# EAGLE design sensor_board3 (EAGLE 9.1.3)
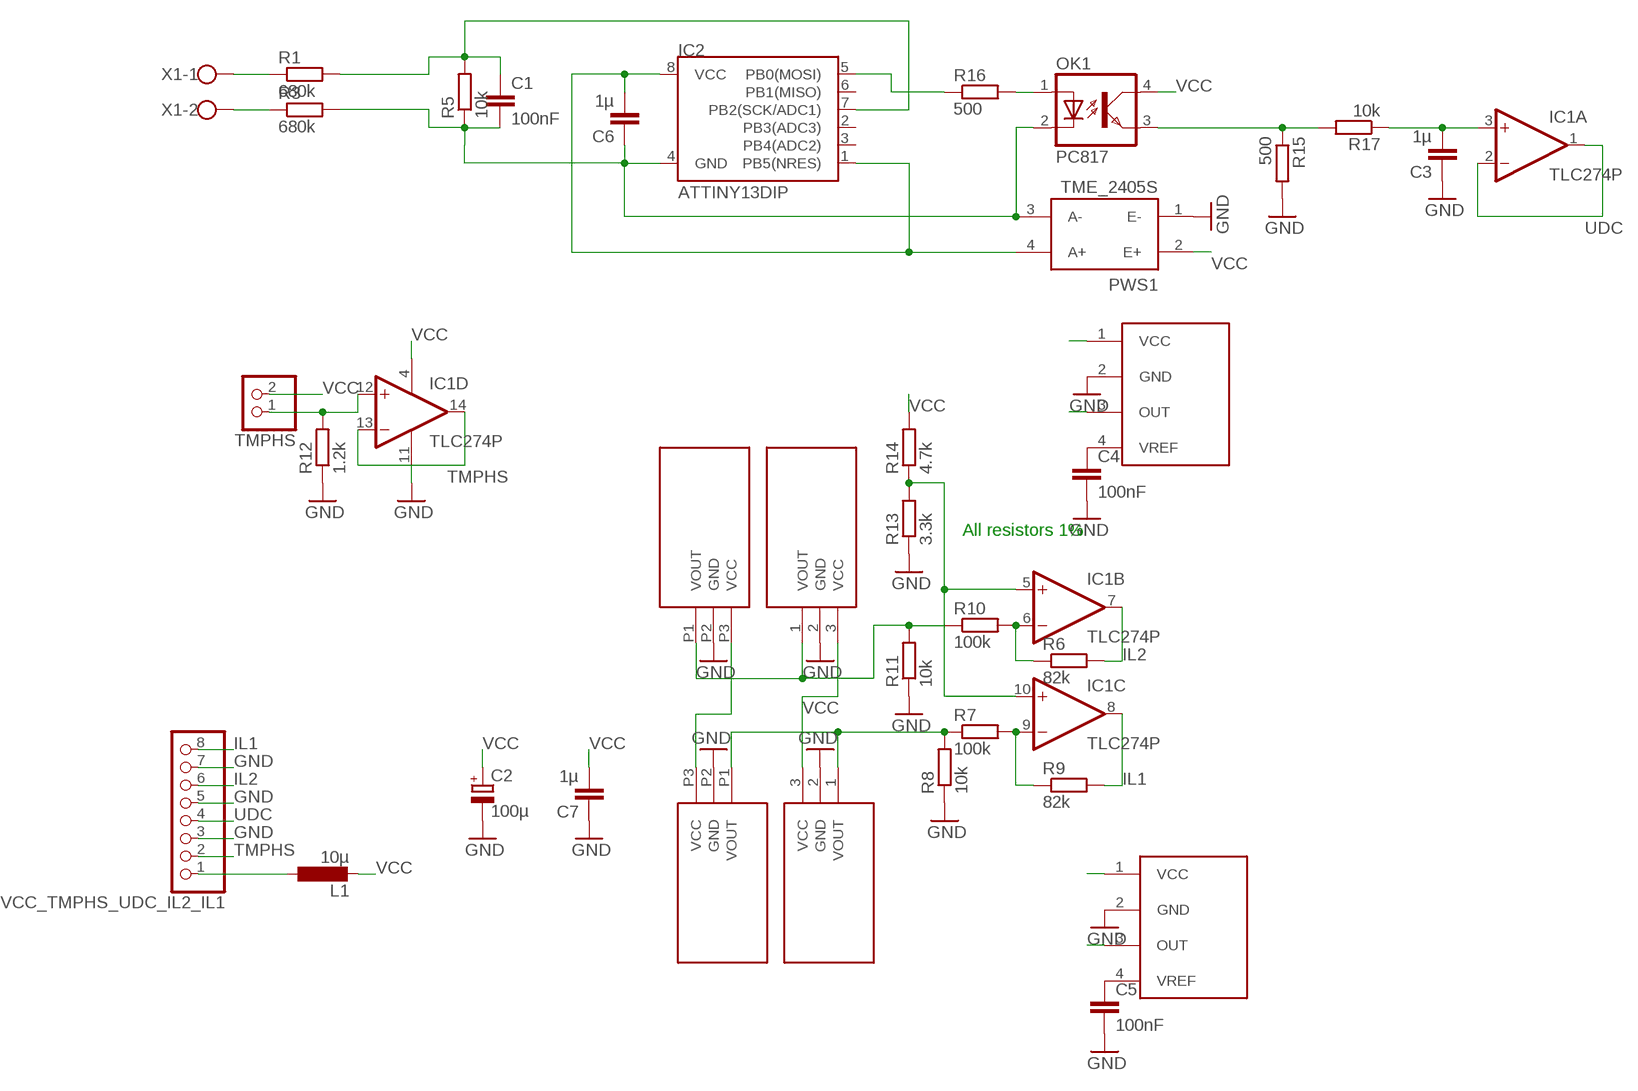
[diagram p0: schematic, sheet 1]

## Parts
C1  100nF  C-EU025-024X044  [C025-024X044]
C2  100µ  CPOL-EUE2,5-6E  [E2,5-6E]
C3  1µ  C-EU025-024X044  [C025-024X044]
C4  100nF  C-EU025-024X044  [C025-024X044]
C5  100nF  C-EU025-024X044  [C025-024X044]
C6  1µ  C-EU025-024X044  [C025-024X044]
C7  1µ  C-EU025-024X044  [C025-024X044]
IC1  TLC274P  [DIL14]
IC2  ATTINY13DIP  [DIP08]
L1  10µ  L-EU0207/12  [0207/12]
OK1  PC817  [DIL04]
PWS1  TME_2405S  [TMEXXXXS]
R1  680k  R-EU_0207/10  [0207/10]
R3  680k  R-EU_0207/10  [0207/10]
R5  10k  R-EU_0207/10  [0207/10]
R6  82k  R-EU_0207/10  [0207/10]
R7  100k  R-EU_0207/10  [0207/10]
R8  10k  R-EU_0207/10  [0207/10]
R9  82k  R-EU_0207/10  [0207/10]
R10  100k  R-EU_0207/10  [0207/10]
R11  10k  R-EU_0207/10  [0207/10]
R12  1.2k  R-EU_0207/10  [0207/10]
R13  3.3k  R-EU_0207/10  [0207/10]
R14  4.7k  R-EU_0207/10  [0207/10]
R15  500  R-EU_0207/10  [0207/10]
R16  500  R-EU_0207/10  [0207/10]
R17  10k  R-EU_0207/10  [0207/10]
TMPHS  PINHD-1X2  [1X02]
U$1  TAMURA_L01Z_S05  [TAMURA_L01Z_S05]
U$2  TAMURA_L01Z_S05  [TAMURA_L01Z_S05]
U$3  HTFS  [HTFS]
U$4  HTFS  [HTFS]
U$5  TAMURA_L06P_S05L06P  [TAMURA_L06P_S05]
U$6  TAMURA_L06P_S05L06P  [TAMURA_L06P_S05]
VCC_TMPHS_UDC_IL2_IL1  PINHD-1X8  [1X08]
X1  W237-102  [W237-102]

## Nets
GND: C2.- C3.1 C4.2 C5.2 C7.1 IC1.11(P:V-) PWS1.1(E-) R8.1 R11.1 R12.1 R13.1 R15.2 U$1.2(GND) U$2.2(GND) U$3.2(GND) U$4.2(GND) U$5.P2(GND) U$6.P2(GND) VCC_TMPHS_UDC_IL2_IL1.3 VCC_TMPHS_UDC_IL2_IL1.5 VCC_TMPHS_UDC_IL2_IL1.7
GND2: C1.2 C6.1 IC2.4(GND) OK1.2(C) PWS1.3(A-) R3.2 R5.1
IL1: IC1.8(C:OUT) R9.2 VCC_TMPHS_UDC_IL2_IL1.8
IL2: IC1.7(B:OUT) R6.2 VCC_TMPHS_UDC_IL2_IL1.6
N$3: IC1.5(B:+IN) IC1.10(C:+IN) R13.2 R14.1
N$4: C1.1 IC2.7(PB2(SCK/ADC1)) R1.2 R5.2
N$5: R1.1 X1.1
N$6: R3.1 X1.2
N$7: L1.1 VCC_TMPHS_UDC_IL2_IL1.1
N$8: IC1.9(C:-IN) R7.2 R9.1
N$9: IC1.6(B:-IN) R6.1 R10.2
N$10: OK1.3(EMIT) R15.1 R17.2
N$11: C4.1 U$3.4(VREF)
N$12: C5.1 U$4.4(VREF)
N$16: IC1.12(D:+IN) R12.2 TMPHS.1
N$17: OK1.1(A) R16.2
N$18: IC2.5(PB0(MOSI)) R16.1
N$19: C3.2 IC1.3(A:+IN) R17.1
TMPHS: IC1.13(D:-IN) IC1.14(D:OUT) VCC_TMPHS_UDC_IL2_IL1.2
UDC: IC1.1(A:OUT) IC1.2(A:-IN) VCC_TMPHS_UDC_IL2_IL1.4
VCC: C2.+ C7.2 IC1.4(P:V+) L1.2 OK1.4(COL) PWS1.2(E+) R14.2 TMPHS.2 U$1.3(VCC) U$2.3(VCC) U$3.1(VCC) U$4.1(VCC) U$5.P3(VCC) U$6.P3(VCC)
VCC2: C6.2 IC2.1(PB5(NRES)) IC2.8(VCC) PWS1.4(A+)
VOUT1: R7.1 R8.2 U$2.1(VOUT) U$4.3(OUT) U$6.P1(VOUT)
VOUT2: R10.1 R11.2 U$1.1(VOUT) U$3.3(OUT) U$5.P1(VOUT)
Unconnected: IC2.2(PB3(ADC3)) IC2.3(PB4(ADC2)) IC2.6(PB1(MISO))

## Notes on the sheet
- All resistors 1%

## Library data of the parts
C1 C3-C7 = rcl:C-EU: CAPACITOR, European symbol
C2 = rcl:CPOL-EU: POLARIZED CAPACITOR, European symbol
IC1 = linear:TLC274: OP AMP
IC2 = SparkFun-DigitalIC:ATTINY13: Atmel 8-pin 1kB flash uC
L1 = rcl:L-EU: INDUCTOR, European symbol
OK1 = optocoupler:PC817: SHARP OPTO COUPLER; MPN: PC817X4J000F; OC_FARNELL: 9707727; OC_NEWARK: 97K7059
PWS1 = traco-electronic:TME_*S: DC/DC Konverter 1 Watt Source: http://www.tracopower.com/datasheet_g/tme-d.pdf; MPN: TME 2405S; OC_FARNELL: 1007547; OC_NEWARK: 51R5329
R1 R3 R5-R17 = rcl:R-EU_: RESISTOR, European symbol
TMPHS = pinhead:PINHD-1X2: PIN HEADER
U$1 U$2 = current sensor:TAMURA_L01Z_S05
U$3 U$4 = lem:HTFS
U$5 U$6 = current sensor:TAMURA_L06P_S05
VCC_TMPHS_UDC_IL2_IL1 = pinhead:PINHD-1X8: PIN HEADER
X1 = con-wago-500:W237-102: WAGO SCREW CLAMP; MPN: 237-102; OC_FARNELL: unknown; OC_NEWARK: 70K9898

## Board
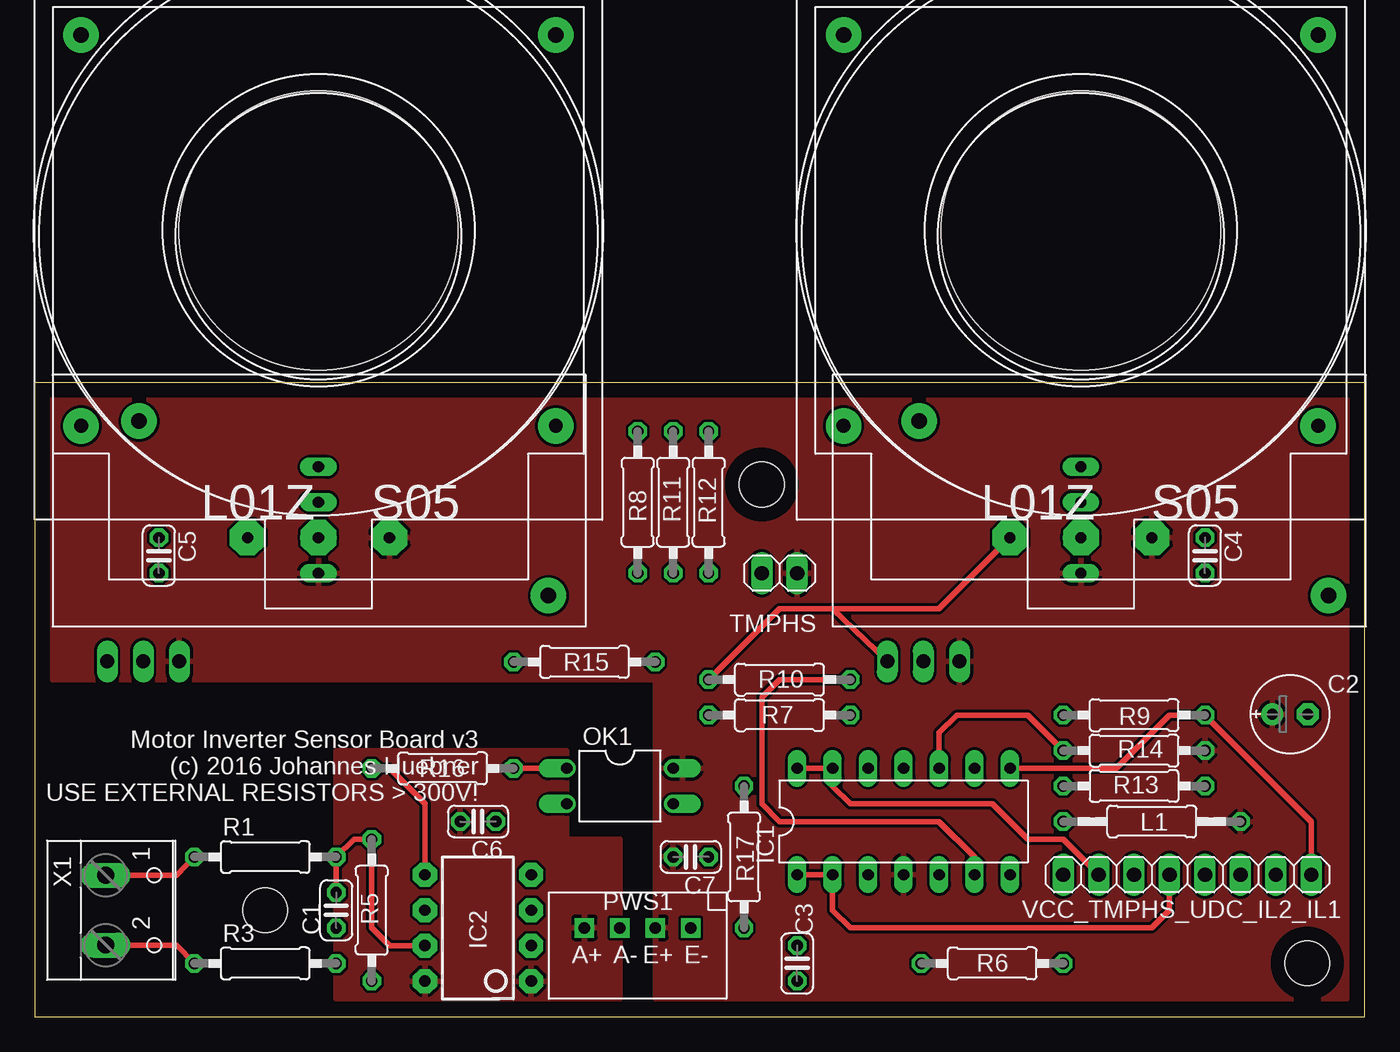
[diagram p1: board, top side]
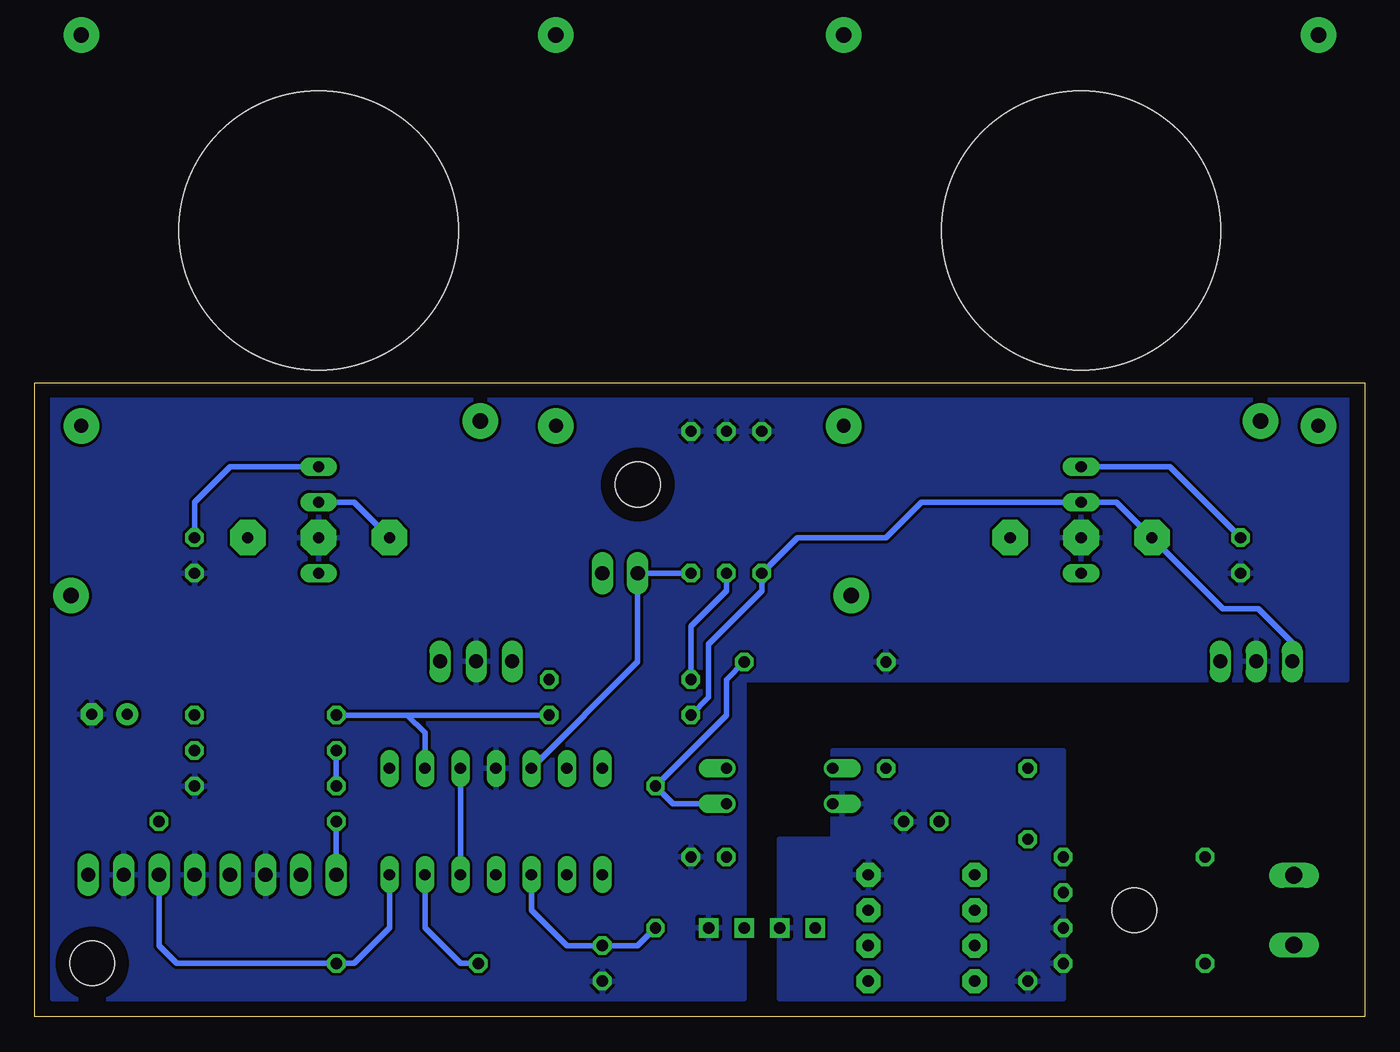
[diagram p2: board, bottom side, seen from below]

Size 95.24 x 45.39 mm. Coordinates in mm from the lower left corner, seen from the top.
Outline: 95.24,0 95.24,45.39 0,45.39 0,0 95.24,0
Copper layers (1*16): Top 0.035mm / dielectric 1.5mm / Bottom 0.035mm
Design rules "default": minimum track width 10mil, minimum drill 24mil, track to track 8mil, track to pad 8mil, pad to pad 8mil, via to via 8mil, smd to smd 8mil, copper to edge 40mil, drill to drill 8mil, minimum pad ring 10mil, minimum via ring 8mil, stop-mask expansion 4mil, vias tented up to drill 0mil, thermal gap 10mil
Holes 3.2 mm at 91.12,3.81 16.5,7.62 52.06,38.1

### Footprints (pad centres in the part's own frame; a part is rotated, then mirrored left to right if it is on the bottom)
C025-024X044 = drill 0.813 octagon: 1 -1.27,0; 2 1.27,0
E2,5-6E = drill 0.813 pad 1.575: + -1.27,0 | drill 0.813 pad 1.575 octagon: - 1.27,0
DIL14 = drill 0.813 long: 1 -7.62,-3.81; 2 -5.08,-3.81; 3 -2.54,-3.81; 4 0,-3.81; 5 2.54,-3.81; 6 5.08,-3.81; 7 7.62,-3.81; 8 7.62,3.81; 9 5.08,3.81; 10 2.54,3.81; 11 0,3.81; 12 -2.54,3.81; 13 -5.08,3.81; 14 -7.62,3.81
DIP08 = drill 0.813 pad 1.727 octagon: 1 -3.81,-3.81; 2 -1.27,-3.81; 3 1.27,-3.81; 4 3.81,-3.81; 5 3.81,3.81; 6 1.27,3.81; 7 -1.27,3.81; 8 -3.81,3.81
0207/12 = drill 0.813 octagon: 1 -6.35,0; 2 6.35,0
DIL04 = drill 0.813 offset: 1 -1.27,-3.81; 2 1.27,-3.81; 3 1.27,3.81; 4 -1.27,3.81
TMEXXXXS = drill 0.813 pad 1.397 square: 1 -3.81,-1.27; 2 -1.27,-1.27; 3 1.27,-1.27; 4 3.81,-1.27
0207/10 = drill 0.813 octagon: 1 -5.08,0; 2 5.08,0
1X02 = drill 1.016 long: 1 -1.27,0; 2 1.27,0
TAMURA_L01Z_S05 = drill 1 long: 1 -3.92,2.5; 2 -6.5,2.5; 3 -9.08,2.5 | drill 1.1 pad 2.54: P$4 -6.2,-14.7; P$5 -35.52,-2.2
HTFS = drill 0.8 long: 1 0,24.13; 2 0,21.59; 3 0,19.05; 4 0,16.51
TAMURA_L06P_S05 = drill 0.8 pad 2.54 octagon: P1 5.08,0; P2 0,0; P3 -5.08,0 | drill 1 pad 2.54: P$4 -17,-8; P$5 17,-8 | drill 1.1 pad 2.54: P$6 -17,-36; P$7 17,-36 | hole 20: 0,-22
1X08 = drill 1.016 long: 1 -8.89,0; 2 -6.35,0; 3 -3.81,0; 4 -1.27,0; 5 1.27,0; 6 3.81,0; 7 6.35,0; 8 8.89,0
W237-102 = drill 1.194 long: 1 -2.5,-1.27; 2 2.5,-1.27

### Placement (x,y rotation side)
C1  21.58,7.62 270 top
C2  89.9,21.65 0 top
C3  54.6,3.81 90 top
C4  83.81,33.02 270 top
C5  8.88,33.02 270 top
C6  31.74,13.97 180 top
C7  46.98,11.43 180 top
IC1  62.22,13.97 0 top
IC2  31.74,6.35 90 top
L1  80,13.97 0 top
OK1  41.9,16.51 270 top
PWS1  43.17,5.08 180 top
R1  16.5,11.43 0 top
R3  16.5,3.81 0 top
R5  24.12,7.62 90 top
R6  68.57,3.81 0 top
R7  53.33,21.59 0 top
R8  43.17,36.83 270 top
R9  78.73,21.59 0 top
R10  53.33,24.13 0 top
R11  45.71,36.83 270 top
R12  48.25,36.83 270 top
R13  78.73,16.51 180 top
R14  78.73,19.05 0 top
R15  39.36,25.4 180 top
R16  29.2,17.78 0 top
R17  50.79,11.43 90 top
TMPHS  53.33,31.75 0 top
U$1  57.14,27.94 180 top
U$2  1.26,27.94 180 top
U$3  74.92,55.88 180 top
U$4  20.31,55.88 180 top
U$5  74.92,34.29 180 top
U$6  20.31,34.29 180 top
VCC_TMPHS_UDC_IL2_IL1  82.54,10.16 0 top
X1  6.34,7.62 270 top

### Tracks (layer width: path | path; a pad name or v marks a point on that pad's centre or on a via)
GND
  pour Bottom: 44.44,1.27 44.44,24.13 1.26,24.13 1.26,44.45 93.97,44.45 93.97,1.27
GND2
  pour Bottom: 41.9,1.27 41.9,12.7 38.09,12.7 38.09,19.05 21.58,19.05 21.58,1.27
IL1
  Top 0.406: VCC_TMPHS_UDC_IL2_IL1.8 91.43,13.97 R9.2 81.27,21.59 77.46,17.78 IC1.8
IL2
  Bottom 0.406: IC1.7 69.84,6.35 72.38,3.81 R6.2 85.08,3.81 86.35,5.08 VCC_TMPHS_UDC_IL2_IL1.6
N$3
  Top 0.406: R14.1 71.11,21.59 66.03,21.59 64.76,20.32 IC1.10
  Bottom 0.406: R14.1 R13.2 | IC1.10 IC1.5
N$4
  Top 0.406: C1.1 R1.2 22.85,12.7 R5.2 24.12,6.35 25.39,5.08 IC2.7
N$5
  Top 0.406: X1.1 10.15,10.12 R1.1
N$6
  Top 0.406: X1.2 10.15,5.12 R3.1
N$7
  Bottom 0.406: VCC_TMPHS_UDC_IL2_IL1.1 L1.1
N$8
  Bottom 0.406: R9.1 68.57,21.59 | 68.57,21.59 67.3,20.32 IC1.9 | R7.2 68.57,21.59
N$9
  Top 0.406: IC1.6 67.3,11.43 64.76,13.97 53.33,13.97 52.06,15.24 52.06,22.86 53.33,24.13 R10.2
  Bottom 0.406: IC1.6 67.3,6.35 64.76,3.81 R6.1
N$10
  Bottom 0.406: OK1.3 49.52,15.24 R17.2 45.71,21.59 45.71,24.13 R15.1
N$11
  Bottom 0.406: C4.1 83.81,36.83 81.27,39.37 U$3.4
N$12
  Bottom 0.406: C5.1 13.96,39.37 U$4.4
N$16
  Bottom 0.406: R12.2 TMPHS.1 52.06,25.4 IC1.12
N$17
  Top 0.406: R16.2 OK1.1
N$18
  Top 0.406: IC2.5 27.93,15.24 25.39,17.78 R16.1
N$19
  Bottom 0.406: R17.1 52.06,5.08 C3.2 57.14,5.08 59.68,7.62 IC1.3
TMPHS
  Top 0.406: IC1.14 IC1.13 57.14,16.51 58.41,15.24 68.57,15.24 71.11,12.7 73.65,12.7 VCC_TMPHS_UDC_IL2_IL1.2
UDC
  Top 0.406: VCC_TMPHS_UDC_IL2_IL1.4 81.27,7.62 80,6.35 58.41,6.35 57.14,7.62 IC1.2 IC1.1
VCC
  pour Top: 44.44,1.27 44.44,24.13 1.26,24.13 1.26,44.45 93.97,44.45 93.97,1.27
VCC2
  pour Top: 21.58,19.05 38.09,19.05 38.09,12.7 41.9,12.7 41.9,1.27 21.58,1.27
VOUT1
  Bottom 0.406: U$2.1 5.18,26.78 7.61,29.21 10.15,29.21 U$6.P1 17.77,36.83 U$4.3 31.74,36.83 34.28,34.29 40.63,34.29 R8.2 43.17,30.48 46.98,26.67 46.98,22.86 R7.1
VOUT2
  Top 0.406: U$5.P1 64.76,29.21 57.14,29.21 | 57.14,29.21 U$1.1 | R10.1 53.33,29.21 57.14,29.21
  Bottom 0.406: R11.2 45.71,30.48 48.25,27.94 R10.1 | U$5.P1 72.38,36.83 U$3.3

### Text on the board
tNames: Motor Inverter Sensor Board v3 / (c) 2016 Johannes Huebner / USE EXTERNAL RESISTORS > 300V!